# EAGLE design TS8 (EAGLE 9.6.2)
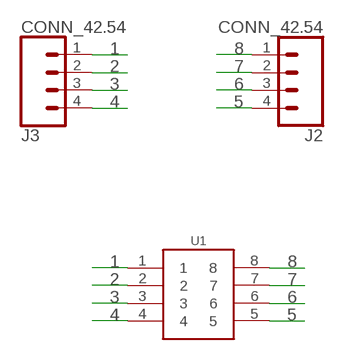
[diagram p0: schematic, sheet 1]

## Parts
J2  CONN_42.54  [1X04]
J3  CONN_42.54  [1X04]
U1  GEN_8TS8  [TS8]

## Nets
1: J3.1 U1.1
2: J3.2 U1.2
3: J3.3 U1.3
4: J3.4 U1.4
5: J2.4 U1.5
6: J2.3 U1.6
7: J2.2 U1.7
8: J2.1 U1.8

## Library data of the parts
J2 J3 = bschulz:CONN_4: Genaric 4 terminal header Digikey 2.54_SCREW <https://www.digikey.com/product-detail/en/on-shore-technology-inc/OSTVN04A150/ED10563-ND/1588864>
U1 = bschulz:GEN_8: Generic 8 Pin Package for Breakout Boards

## Board
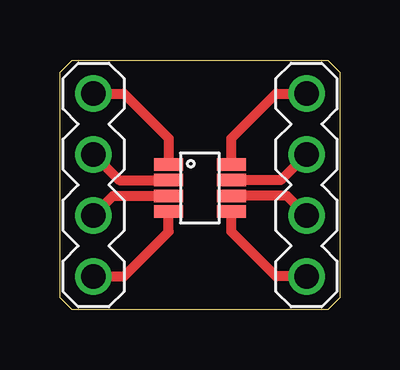
[diagram p1: board, top side]
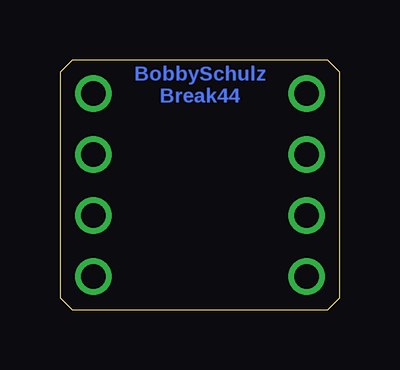
[diagram p2: board, bottom side, seen from below]

Size 11.68 x 10.41 mm. Coordinates in mm from the lower left corner, seen from the top.
Outline: 0,0.5 0,9.91 0.5,10.41 11.18,10.41 11.68,9.91 11.68,0.5 11.18,0 0.5,0 0,0.5
Copper layers (1*16): Top 0.035559375mm / dielectric 1.6mm / Bottom 0.035559375mm
Design rules "jlcpcb-2layer": minimum track width 5mil, minimum drill 0.2mm, track to track 5mil, track to pad 6mil, pad to pad 5mil, via to via 6mil, smd to smd 5mil, copper to edge 15mil, drill to drill 6mil, minimum pad ring 5mil, minimum via ring 5mil, stop-mask expansion 2.5mil, vias tented up to drill 0mil, thermal gap 10mil

### Footprints (pad centres in the part's own frame; a part is rotated, then mirrored left to right if it is on the bottom)
1X04 = drill 1.016: 1 -3.81,0; 2 -1.27,0; 3 1.27,0; 4 3.81,0
TS8 = smd 1.22 x 0.52: 1 -1.31,0.975; 2 -1.31,0.325; 3 -1.31,-0.325; 4 -1.31,-0.975; 5 1.31,-0.975; 6 1.31,-0.325; 7 1.31,0.325; 8 1.31,0.975

### Placement (x,y rotation side)
J2  10.29,5.21 270 top
J3  1.4,5.21 270 top
U1  5.84,5.08 0 top

### Tracks (layer width: path | path; a pad name or v marks a point on that pad's centre or on a via)
1
  Top 0.406: J3.1 2.67,9.02 4.53,7.15 U1.1
2
  Top 0.406: J3.2 2.47,5.41 U1.2
3
  Top 0.406: J3.3 2.21,4.75 U1.3
4
  Top 0.406: J3.4 2.67,1.4 4.53,3.26 U1.4
5
  Top 0.406: J2.4 9.02,1.4 7.15,3.26 U1.5
6
  Top 0.406: J2.3 9.47,4.75 U1.6
7
  Top 0.406: J2.2 9.21,5.41 U1.7
8
  Top 0.406: U1.8 7.15,7.15 9.02,9.02 J2.1

### Text on the board
Bottom: BobbySchulz / Break44
tDocu: 1 | 8 | 2 | 7 | 3 | 6 | TS8 | 4 | 5